# EAGLE schematic 12v_to_3v3.dbl (EAGLE 9.2.0)
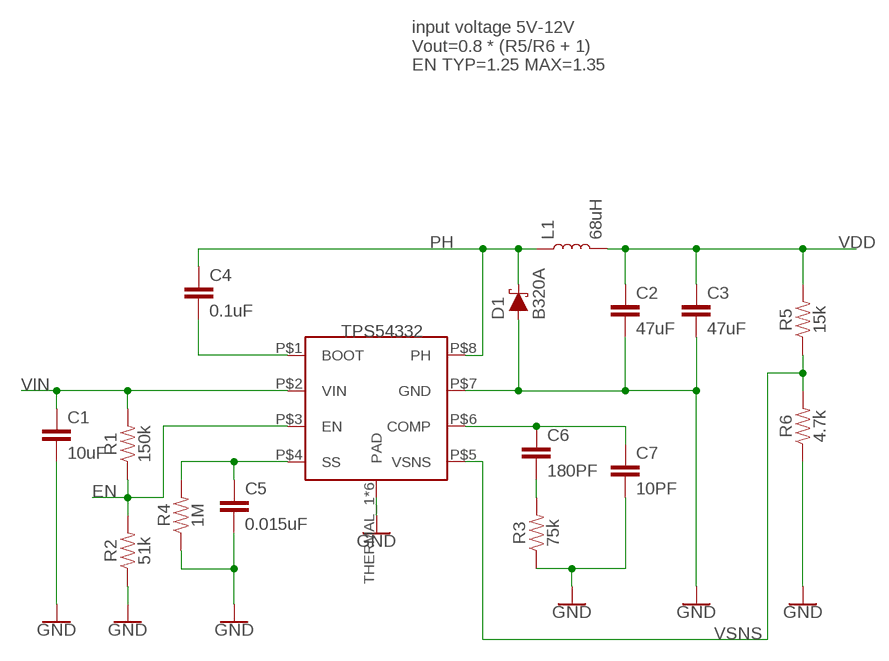
[diagram p0: schematic, sheet 1]

## Parts
C1  10uF  10UF-0805-10V-10%  [0805]
C2  47uF  22UF-0805-6.3V-20%  [0805]
C3  47uF  22UF-0805-6.3V-20%  [0805]
C4  0.1uF  0.1UF-0402-16V-10%  [0402]
C5  0.015uF  0.1UF-0402-16V-10%  [0402]
C6  180PF  100PF-0402-50V-5%  [0402]
C7  10PF  100PF-0402-50V-5%  [0402]
D1  B320A  [SMA]
L1  68uH  100UH_SMD  [1210]
R1  150k  RESISTOR0402  [0402]
R2  51k  RESISTOR0402  [0402]
R3  75k  RESISTOR0402  [0402]
R4  1M  RESISTOR0402  [0402]
R5  15k  RESISTOR0402  [0402]
R6  4.7k  RESISTOR0402  [0402]
U1  TPS54332A  [DDA(8-POWERSOIC)_THERAL]

## Nets
EN: R1.1 R2.2 U1.P$3(EN)
GND: C1.2 C2.2 C3.2 C5.2 C7.2 D1.A R2.1 R3.1 R4.1 R6.1 U1.P$7(GND) U1.THERMAL_1(PAD) U1.THERMAL_2(PAD) U1.THERMAL_3(PAD) U1.THERMAL_4(PAD) U1.THERMAL_5(PAD) U1.THERMAL_6(PAD)
N$4: C5.1 R4.2 U1.P$4(SS)
N$5: C4.2 U1.P$1(BOOT)
N$11: C6.1 C7.1 U1.P$6(COMP)
N$13: C6.2 R3.2
PH: C4.1 D1.C L1.P$1 U1.P$8(PH)
VDD: C2.1 C3.1 L1.P$2 R5.2
VIN: C1.1 R1.2 U1.P$2(VIN)
VSNS: R5.1 R6.2 U1.P$5(VSNS)

## Notes on the sheet
- input voltage 5V-12V
  Vout=0.8 * (R5/R6 + 1)
  EN TYP=1.25 MAX=1.35

## Library data of the parts
C1 = SparkFun-Capacitors:10UF: 10.0µF ceramic capacitors A capacitor is a passive two-terminal electrical component used to store electrical energy temporarily in an electric field.; PROD_ID: CAP-11330
C2 C3 = SparkFun-Capacitors:22UF: 22µF ceramic capacitors A capacitor is a passive two-terminal electrical component used to store electrical energy temporarily in an electric field.; PROD_ID: CAP-08402; VALUE: 22uF
C4 = SparkFun-Capacitors:0.1UF: 0.1µF ceramic capacitors A capacitor is a passive two-terminal electrical component used to store electrical energy temporarily in an electric field.; PROD_ID: CAP-12416
C5 = SparkFun-Capacitors:0.1UF: 0.1µF ceramic capacitors A capacitor is a passive two-terminal electrical component used to store electrical energy temporarily in an electric field.; PROD_ID: CAP-12416; VALUE: 0.1uF
C6 C7 = SparkFun-Capacitors:100PF: 100pF/0.1nF ceramic capacitors A capacitor is a passive two-terminal electrical component used to store electrical energy temporarily in an electric field.; PROD_ID: CAP-13458; VALUE: 100PF
D1 = diodes:B320A: B320A datasheet:https://www.diodes.com/assets/Datasheets/B320AE-B345AE.pdf
L1 = incuctor:100UH_SMD: datasheet: https://www.digikey.com/product-detail/en/taiyo-yuden/BRL3225T101K/587-2170-1-ND/2002868
R1-R6 = SparkFun-Resistors:RESISTOR: Generic Resistor Package
U1 = power:TPS54332